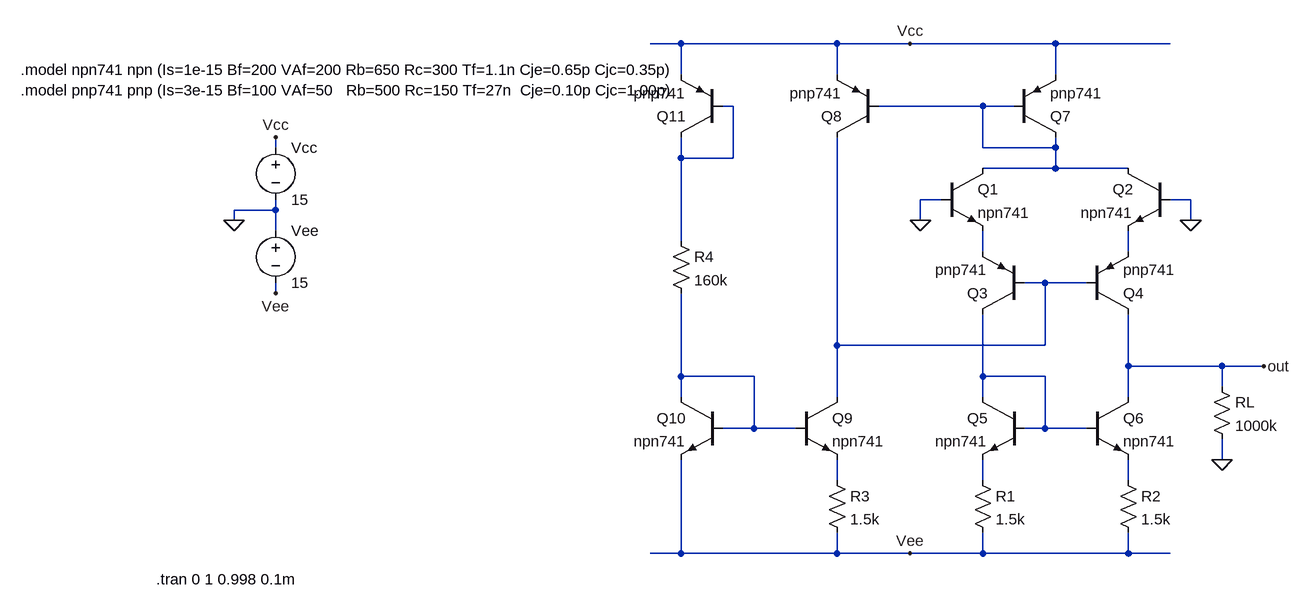
[diagram p0: schematic dc-analysis.asc]
dc-analysis.asc, the LTspice schematic file:
Version 4
SHEET 1 956 680
WIRE 16 -208 -32 -208
WIRE 256 -208 16 -208
WIRE 368 -208 256 -208
WIRE 592 -208 368 -208
WIRE 768 -208 592 -208
WIRE 16 -160 16 -208
WIRE 256 -160 256 -208
WIRE 592 -160 592 -208
WIRE 96 -112 80 -112
WIRE 480 -112 320 -112
WIRE 528 -112 480 -112
WIRE -608 -48 -608 -64
WIRE 480 -48 480 -112
WIRE 592 -48 592 -64
WIRE 592 -48 480 -48
WIRE 16 -32 16 -64
WIRE 96 -32 96 -112
WIRE 96 -32 16 -32
WIRE 592 -16 592 -48
WIRE 592 -16 480 -16
WIRE 704 -16 592 -16
WIRE 416 32 384 32
WIRE 800 32 768 32
WIRE -608 48 -608 32
WIRE -608 48 -672 48
WIRE -672 64 -672 48
WIRE 384 64 384 32
WIRE 800 64 800 32
WIRE -608 80 -608 48
WIRE 16 96 16 -32
WIRE 480 112 480 80
WIRE 704 112 704 80
WIRE 576 160 544 160
WIRE 640 160 576 160
WIRE -608 176 -608 160
WIRE 256 256 256 -64
WIRE 576 256 576 160
WIRE 576 256 256 256
WIRE 704 288 704 208
WIRE 848 288 704 288
WIRE 912 288 848 288
WIRE 16 304 16 176
WIRE 128 304 16 304
WIRE 480 304 480 208
WIRE 576 304 480 304
WIRE 848 320 848 288
WIRE 16 336 16 304
WIRE 256 336 256 256
WIRE 480 336 480 304
WIRE 704 336 704 288
WIRE 128 384 128 304
WIRE 128 384 80 384
WIRE 192 384 128 384
WIRE 576 384 576 304
WIRE 576 384 544 384
WIRE 640 384 576 384
WIRE 848 432 848 400
WIRE 256 464 256 432
WIRE 480 464 480 432
WIRE 704 464 704 432
WIRE 16 576 16 432
WIRE 16 576 -32 576
WIRE 256 576 256 544
WIRE 256 576 16 576
WIRE 368 576 256 576
WIRE 480 576 480 544
WIRE 480 576 368 576
WIRE 704 576 704 544
WIRE 704 576 480 576
WIRE 768 576 704 576
FLAG -672 64 0
FLAG -608 -64 Vcc
FLAG 368 -208 Vcc
FLAG -608 176 Vee
FLAG 368 576 Vee
FLAG 912 288 out
FLAG 848 432 0
FLAG 384 64 0
FLAG 800 64 0
SYMBOL pnp 80 -64 R180
SYMATTR InstName Q11
SYMATTR Value pnp741
SYMBOL res 0 80 R0
SYMATTR InstName R4
SYMATTR Value 160k
SYMBOL npn 80 336 M0
SYMATTR InstName Q10
SYMATTR Value npn741
SYMBOL npn 192 336 R0
SYMATTR InstName Q9
SYMATTR Value npn741
SYMBOL pnp 320 -64 R180
SYMATTR InstName Q8
SYMATTR Value pnp741
SYMBOL pnp 528 -64 M180
SYMATTR InstName Q7
SYMATTR Value pnp741
SYMBOL npn 416 -16 R0
SYMATTR InstName Q1
SYMATTR Value npn741
SYMBOL npn 768 -16 M0
SYMATTR InstName Q2
SYMATTR Value npn741
SYMBOL pnp 544 208 R180
SYMATTR InstName Q3
SYMATTR Value pnp741
SYMBOL pnp 640 208 M180
SYMATTR InstName Q4
SYMATTR Value pnp741
SYMBOL npn 640 336 R0
SYMATTR InstName Q6
SYMATTR Value npn741
SYMBOL npn 544 336 M0
SYMATTR InstName Q5
SYMATTR Value npn741
SYMBOL res 240 448 R0
SYMATTR InstName R3
SYMATTR Value 1.5k
SYMBOL res 464 448 R0
SYMATTR InstName R1
SYMATTR Value 1.5k
SYMBOL res 688 448 R0
SYMATTR InstName R2
SYMATTR Value 1.5k
SYMBOL voltage -608 -64 R0
WINDOW 123 0 0 Left 0
WINDOW 39 0 0 Left 0
SYMATTR InstName Vcc
SYMATTR Value 15
SYMBOL voltage -608 64 R0
WINDOW 123 0 0 Left 0
WINDOW 39 0 0 Left 0
SYMATTR InstName Vee
SYMATTR Value 15
SYMBOL res 832 304 R0
SYMATTR InstName RL
SYMATTR Value 1000k
TEXT -792 616 Left 2 !.tran 0 1 0.998 0.1m
TEXT -1000 -168 Left 2 !.model npn741 npn (Is=1e-15 Bf=200 VAf=200 Rb=650 Rc=300 Tf=1.1n Cje=0.65p Cjc=0.35p)
TEXT -1000 -136 Left 2 !.model pnp741 pnp (Is=3e-15 Bf=100 VAf=50   Rb=500 Rc=150 Tf=27n  Cje=0.10p Cjc=1.00p)

The netlist it stands for:
* dc-analysis.asc
Q11 N001 N001 Vcc 0 pnp741
R4 N001 N006 160k
Q10 N006 N006 Vee 0 npn741
Q9 N005 N006 N008 0 npn741
Q8 N005 N002 Vcc 0 pnp741
Q7 N002 N002 Vcc 0 pnp741
Q1 N002 0 N003 0 npn741
Q2 N002 0 N004 0 npn741
Q3 N007 N005 N003 0 pnp741
Q4 out N005 N004 0 pnp741
Q6 out N007 N010 0 npn741
Q5 N007 N007 N009 0 npn741
R3 N008 Vee 1.5k
R1 N009 Vee 1.5k
R2 N010 Vee 1.5k
Vcc Vcc 0 15
Vee 0 Vee 15
RL out 0 1000k
.model NPN NPN
.model PNP PNP
.lib standard.bjt
.tran 0 1 0.998 0.1m
.model npn741 npn (Is=1e-15 Bf=200 VAf=200 Rb=650 Rc=300 Tf=1.1n Cje=0.65p Cjc=0.35p)
.model pnp741 pnp (Is=3e-15 Bf=100 VAf=50   Rb=500 Rc=150 Tf=27n  Cje=0.10p Cjc=1.00p)
.backanno
.end